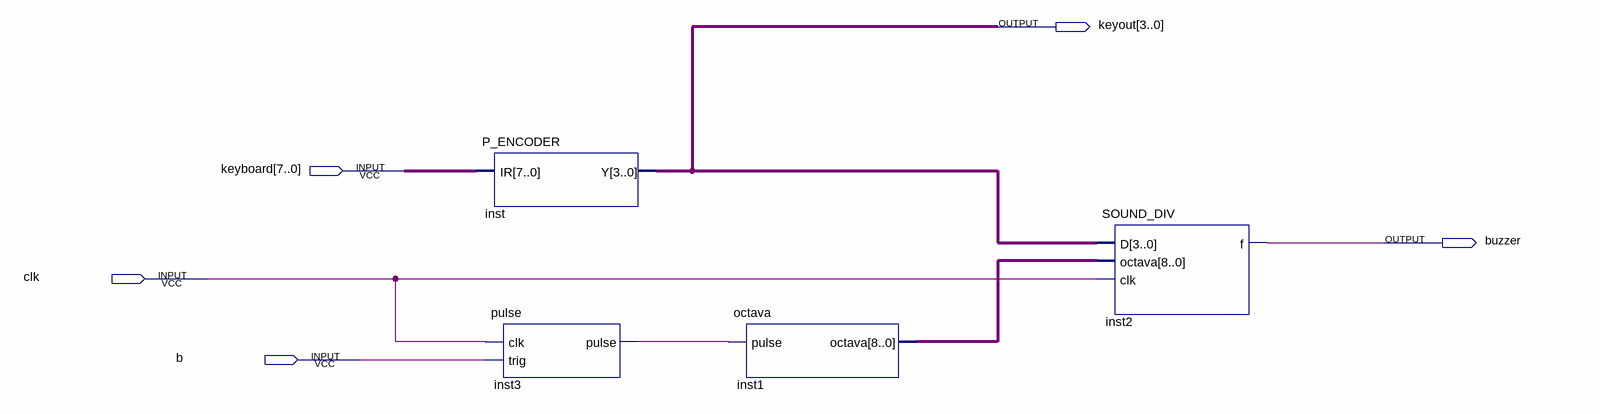
[diagram p0: schematic sheet]
// Quartus schematic keyboard.bdf as structural Verilog: 4 symbols, 5 pins
module keyboard (
  input  [7:0] keyboard,
  input  clk,
  input  b,
  output [3:0] keyout,
  output buzzer
);

  wire inst3_pulse;
  wire [8:0] inst1_octava;

  P_ENCODER inst (.IR(keyboard), .Y(keyout));
  pulse inst3 (.clk(clk), .trig(b), .pulse(inst3_pulse));
  octava inst1 (.pulse(inst3_pulse), .octava(inst1_octava));
  SOUND_DIV inst2 (.D(keyout), .octava(inst1_octava), .clk(clk), .f(buzzer));
endmodule
